# Altium schematic sheet RESET-SWITCHES.SchDoc
size A4; SPICEModelCacheRHDPLAFM: <root> / <DocumentId>RHDPLAFM</DocumentId> / </root>; SheetNumber: 4; SheetTotal: 7
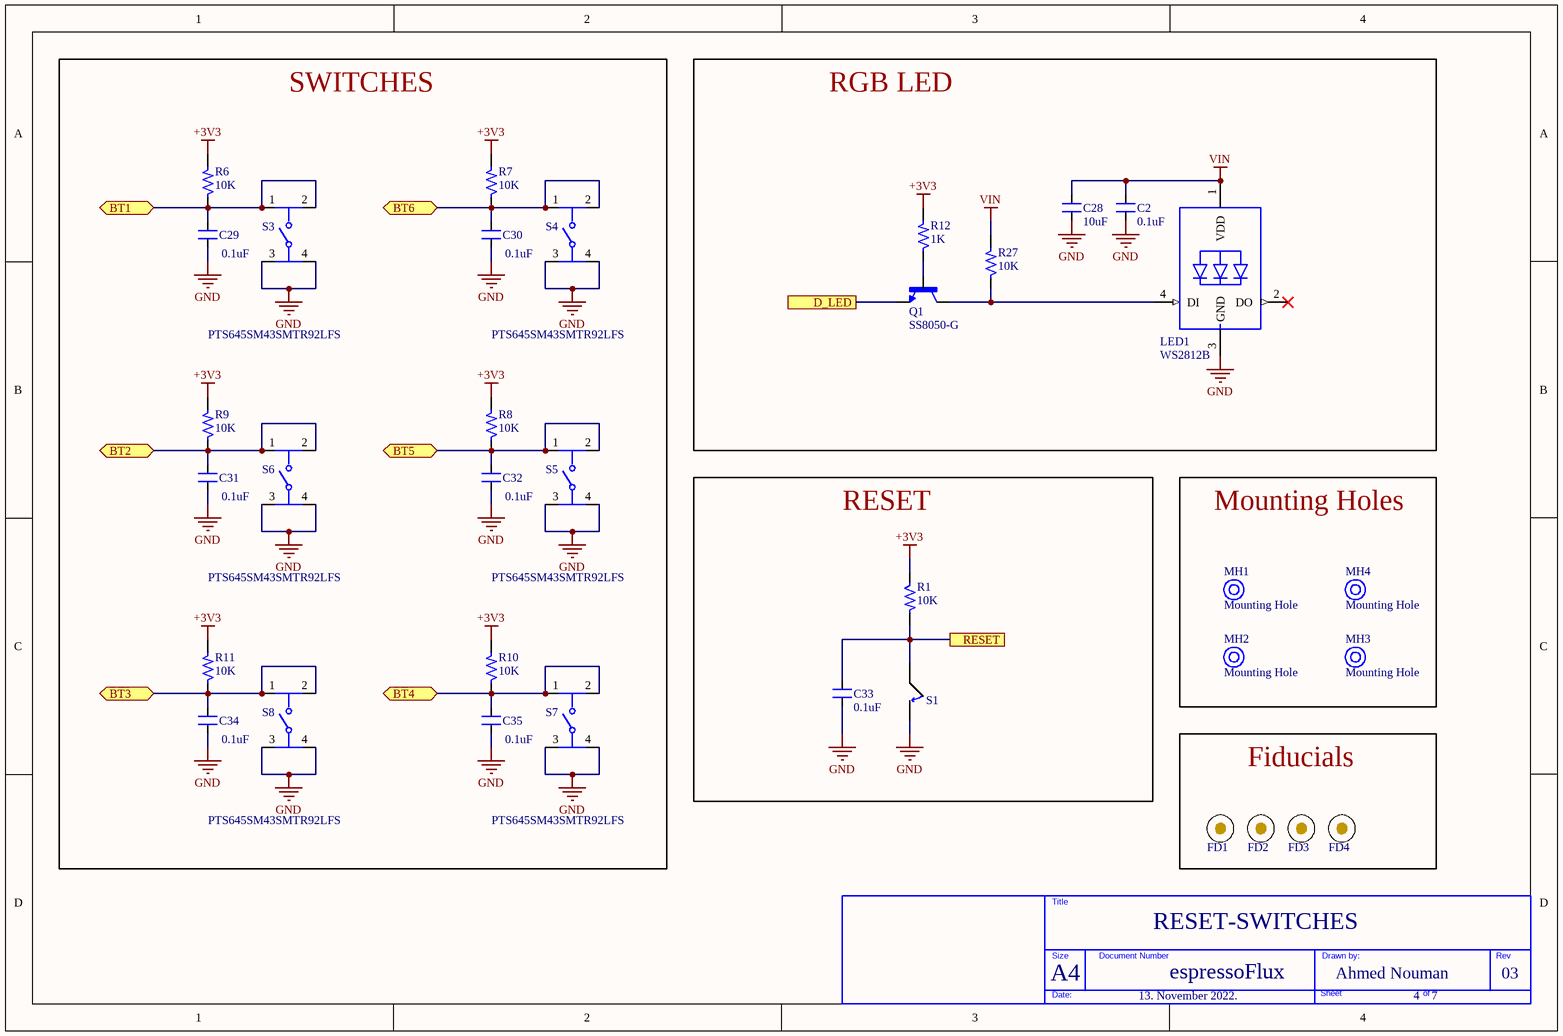
[diagram p0: RESET-SWITCHES.SchDoc]

## Parts
?  (no value)  (graphical)
C2  0.1uF  [CAP_0805]
C28  10uF  [CAP_0805]
C29  0.1uF  [CAP_0805]
C30  0.1uF  [CAP_0805]
C31  0.1uF  [CAP_0805]
C32  0.1uF  [CAP_0805]
C33  0.1uF  [CAP_0805]
C34  0.1uF  [CAP_0805]
C35  0.1uF  [CAP_0805]
FD1  Fiducial  [FIDUCIAL-TB-1mm]  (value not drawn)
FD2  Fiducial  [FIDUCIAL-TB-1mm]  (value not drawn)
FD3  Fiducial  [FIDUCIAL-TB-1mm]  (value not drawn)
FD4  Fiducial  [FIDUCIAL-TB-1mm]  (value not drawn)
LED1  WS2812B  [WS2812B]
MH1  Mounting Hole  [MOUNTING-NO-COPPER]
MH2  Mounting Hole  [MOUNTING-NO-COPPER]
MH3  Mounting Hole  [MOUNTING-NO-COPPER]
MH4  Mounting Hole  [MOUNTING-NO-COPPER]
Q1  SS8050-G  [TRANS_NPN_SS8050-G]
R1  10K  [RES_0805]
R6  10K  [RES_0805]
R7  10K  [RES_0805]
R8  10K  [RES_0805]
R9  10K  [RES_0805]
R10  10K  [RES_0805]
R11  10K  [RES_0805]
R12  1K  [RES_0805]
R27  10K  [RES_0805]
S1  Button Tactile Switch, NO 0.05 A 0.8mm  [Button8014X17N]  (value not drawn)
S3  PTS645SM43SMTR92LFS  [C&K_0_MFG - duplicate]
S4  PTS645SM43SMTR92LFS  [C&K_0_MFG - duplicate]
S5  PTS645SM43SMTR92LFS  [C&K_0_MFG - duplicate]
S6  PTS645SM43SMTR92LFS  [C&K_0_MFG - duplicate]
S7  PTS645SM43SMTR92LFS  [C&K_0_MFG - duplicate]
S8  PTS645SM43SMTR92LFS  [C&K_0_MFG - duplicate]

## Blocks framed on the sheet
SWITCHES: C29-C32 C34 C35 R6-R11 S3-S8
RGB LED: C2 C28 LED1 Q1 R12 R27
RESET: C33 R1 S1
Mounting Holes: MH1-MH4
Fiducials: FD1-FD4

## Ports
BT1 (bidir), BT2 (bidir), BT3 (bidir), BT4 (bidir), BT5 (bidir), BT6 (bidir), D_LED, RESET

## Nets
+3V3: R1.1 R6.2 R7.2 R8.2 R9.2 R10.2 R11.2 R12.2
GND: C2.1 C28.1 C29.1 C30.1 C31.1 C32.1 C33.1 C34.1 C35.1 LED1.3(GND) S1.2 S3.3 S3.4 S4.3 S4.4 S5.3 S5.4 S6.3 S6.4 S7.3 S7.4 S8.3 S8.4
VIN: C2.2 C28.2 LED1.1(VDD) R27.2
BT1: C29.2 R6.1 S3.1 S3.2 ; port BT1
BT2: C31.2 R9.1 S6.1 S6.2 ; port BT2
BT3: C34.2 R11.1 S8.1 S8.2 ; port BT3
BT4: C35.2 R10.1 S7.1 S7.2 ; port BT4
BT5: C32.2 R8.1 S5.1 S5.2 ; port BT5
BT6: C30.2 R7.1 S4.1 S4.2 ; port BT6
D_LED: Q1.2(E) ; port D_LED
RESET: C33.2 R1.2 S1.1 ; port RESET
NetLED1_4: LED1.4(DI) Q1.3(C) R27.1
NetQ1_1: Q1.1(B) R12.1

Not connected (* = marked no-connect by the designer): LED1 2(DO)*

## Notes on the sheet
- A4
- RESET-SWITCHES
- espressoFlux
- Ahmed Nouman
- 03
- 13. November 2022.
- 4    7
- Title
- Size
- Document Number
- Drawn by:
- Rev
- Date:
- Sheet
- of

## Library data of the parts
? = TITLE BLOCK_BLANK
C2 C29-C35 = CAP_0.1uF-50V-10%-0805: 0.1µF ±10% 50V Ceramic Capacitor X7R 0805 (2012 Metric); Manufacturer: Samsung; Manufacturer Part Number: CL21B104KBCNNNC; Alternate Part Number-1: NA; Case/Package: 0805; Supplier-1: SIRICOM; Supplier Part Number-1: 0805B104K500CT
C28 = CAP_10uF-50V-10%-0805_1: 10µF ±10% 50V Ceramic Capacitor X7R 0805 (2012 Metric); Manufacturer: Samsung; Manufacturer Part Number: CL21B104KBCNNNC; Alternate Part Number-1: NA; Case/Package: 0805; Supplier-1: SIRICOM; Supplier Part Number-1: 0805B104K500CT
FD1-FD4 = Fiducial: Fiducial mark; SymbolCreator: codlsc; SymbolVersion: 2009-11-4; CompType: Fiducial; Publisher: Texas Instruments; LatestRevisionDate: 2013-07-11; LatestRevisionNote: Added Alternate PartNumber and Alternate Manufacturer parameters to appropriate components.; Manufacturer: N/A; MountType: N/A; PackageReference: Fiducial; PartNumber: N/A; ClassName: FiducialMark
LED1 = WS2812B: Raspberry Pi HAT _40 pin_ Wheeled Robotics Kit; MF: SparkFun Electronics; Availability: Unavailable; SnapEDA_Link: https://www.snapeda.com/parts/WS2812B/Worldsemi/view-part/1038297/?ref=snap; MP: WS2812B; Price: None; Value: *; Package: None
MH1-MH4 = MH_3H_ONLY_1: Manufacturer Part Number: NA; Case/Package: TH; Manufacturer: NA; Supplier-1: NA; Supplier Part Number-1: NA; Alternate Part Number-1: NA
Q1 = TRANS_NPN_SS8050-G: Bipolar (BJT) Transistor NPN 25 V 1.5 A 100MHz 300 mW Surface Mount SOT-23-3
R1 R6-R11 = RES_10K-0.125W-1%-0805: 10 kOhms ±1% 0.125W, 1/8W Chip Resistor 0805 (2012 Metric) Automotive AEC-Q200 Thick Film; Manufacturer: CTS; Manufacturer Part Number: WR08X1002FTL; Case/Package: 0805; Supplier-1: SIRICOM; Supplier Part Number-1: WR08X1002FTL; Alternate Part Number-1: WR08X1002FTL
R12 = RES_330R-0.125W-1%-0805: 1 KOhms ±1% 0.125W, 1/8W Chip Resistor 0805 (2012 Metric) Automotive AEC-Q200 Thick Film; Manufacturer: Walsin; Manufacturer Part Number: WR08X3300FTL; Alternate Part Number-1: NA; Case/Package: 0805; Supplier-1: SIRICOM; Supplier Part Number-1: WR08X3300FTL
R27 = RES_330R-0.125W-1%-0805: 10 KOhms ±1% 0.125W, 1/8W Chip Resistor 0805 (2012 Metric) Automotive AEC-Q200 Thick Film; Manufacturer: Walsin; Manufacturer Part Number: WR08X3300FTL; Alternate Part Number-1: NA; Case/Package: 0805; Supplier-1: SIRICOM; Supplier Part Number-1: WR08X3300FTL
S1 = Button Tactile Switch, NO 0.05 A 0.8mm: Manufacturer: C & K; Manufacturer Part No.: B3F1000; State: Normaly Open; Date Created: 25 February 2015; Creator: R Kanjee; RS Stock No.: 516-255
S3-S8 = SW_TACTILE_PTS645SM43SMTR92LFS